# Altium project LaunchpadStepperXY.PrjPCB
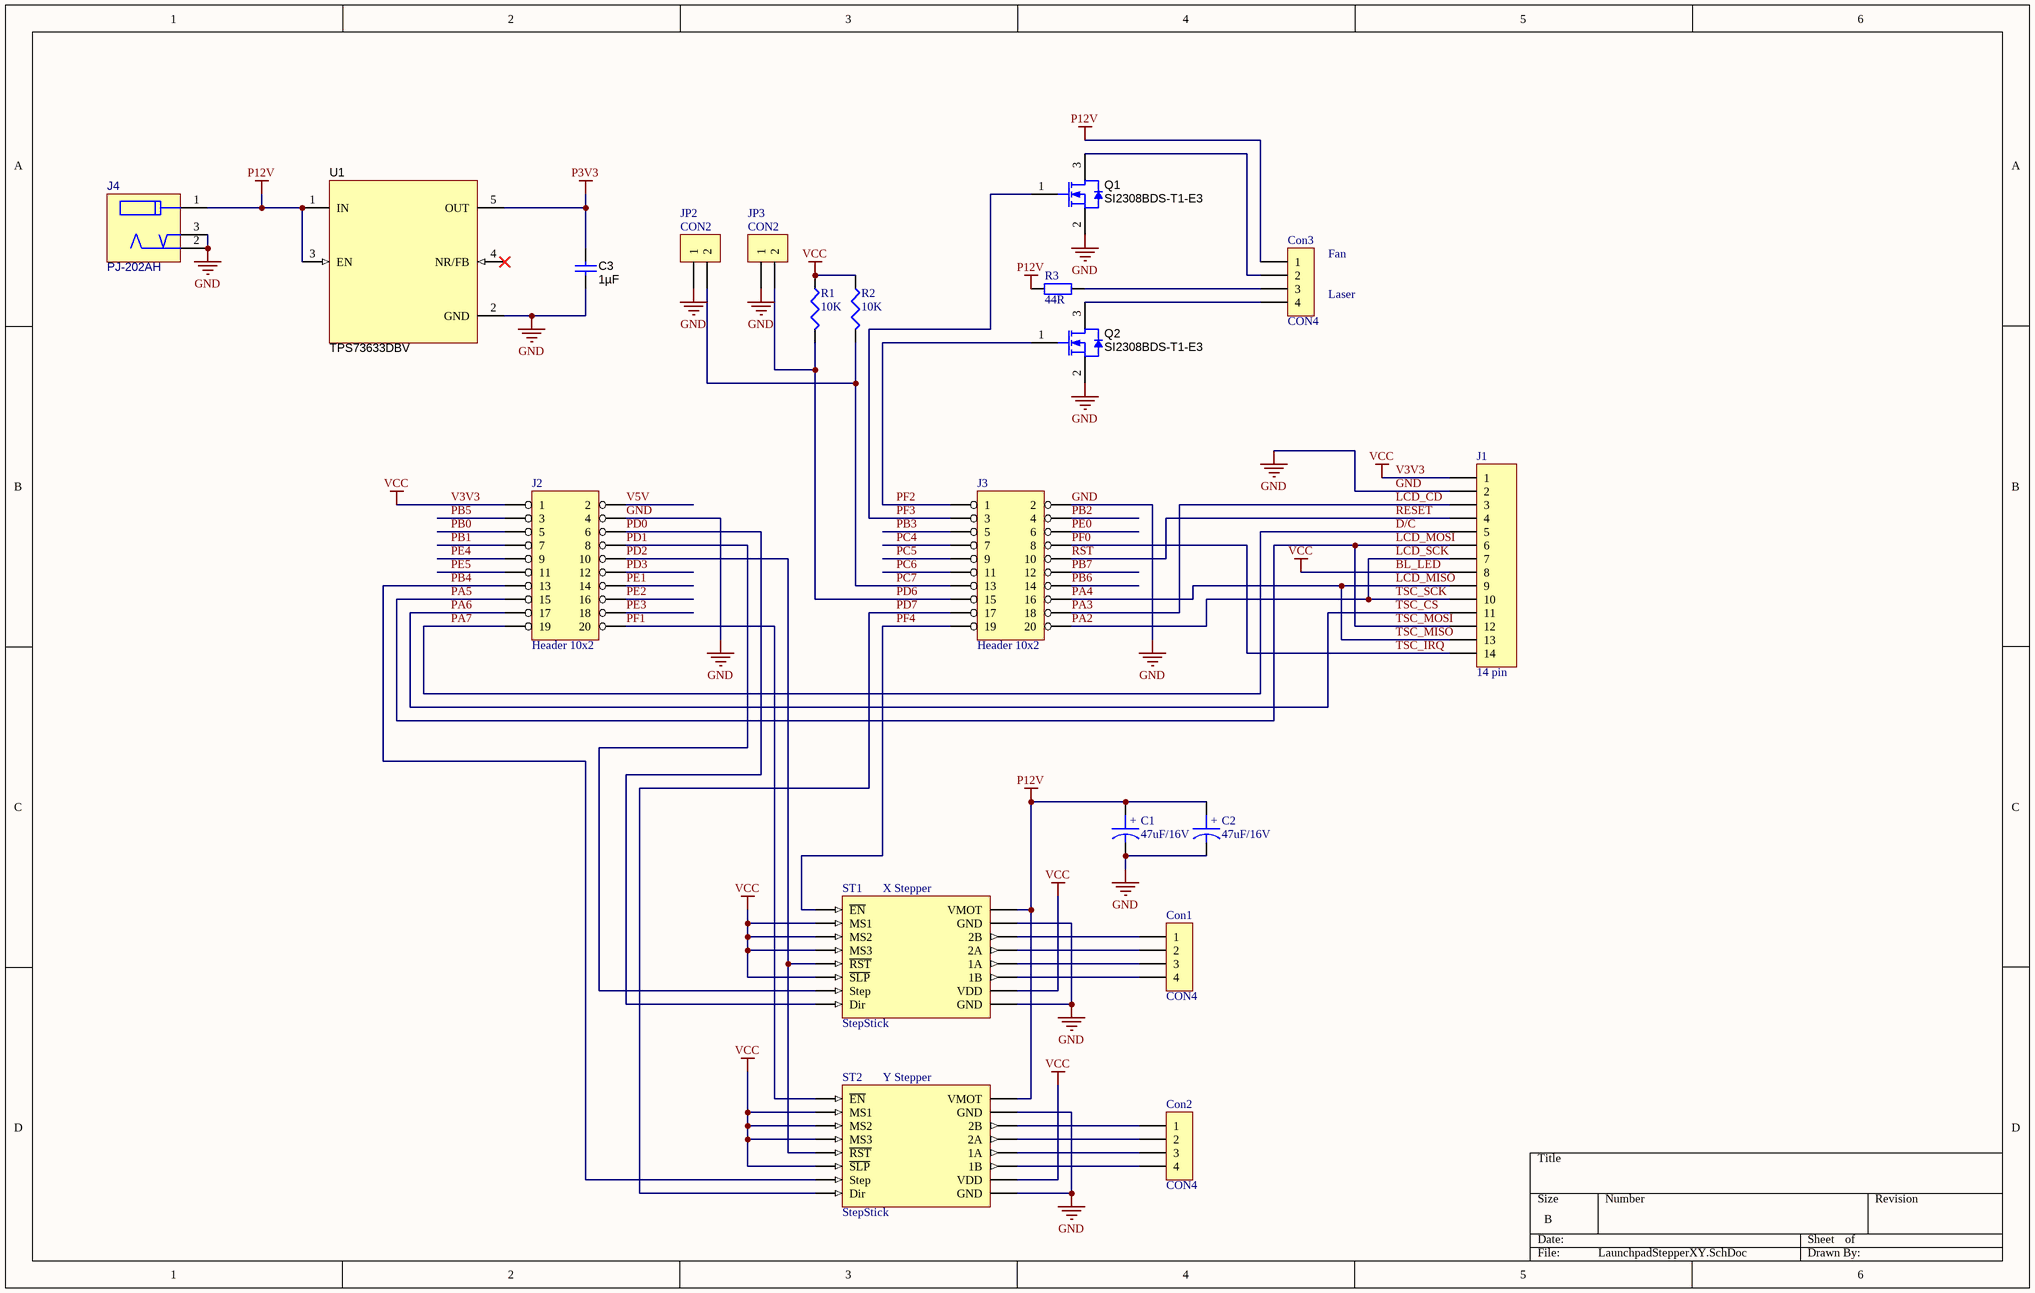
[diagram p0: LaunchpadStepperXY.SchDoc]
1 sheet, 20 parts. Net scope: global (net labels, ports and power ports of the same name join across sheets).
Board file: LaunchpadStepperXY.PcbDoc

## Sheet LaunchpadStepperXY.SchDoc
size B

### Parts
C1  47uF/16V  [PanasonicD]
C2  47uF/16V  [PanasonicD]
C3  ValueDisplayed: 1µF  [0603]  (hidden comment: UMK107AB7105KA-T)
Con1  CON4  [SIP4]
Con2  CON4  [SIP4]
Con3  CON4  [SIP4]
J1  14 pin  [SIP14]
J2  Header 10x2  [IDC20]
J3  Header 10x2  [IDC20]
J4  PJ-202AH  [CONN_CUI-PJ-202AH]
JP2  CON2  [SIP2]
JP3  CON2  [SIP2]
Q1  SI2308BDS-T1-E3  [SOT-23]
Q2  SI2308BDS-T1-E3  [SOT-23]
R1  10K  [0603]
R2  10K  [0603]
R3  44R  [AXIAL-0.4]
ST1  StepStick  [StepStick]
ST2  StepStick  [StepStick]
U1  TPS73633DBV  [DBV0005A_N]

### Nets
BL_LED: J1.1 J1.8 J2.1 R1.1 R2.1 ST1.2(MS1) ST1.3(MS2) ST1.4(MS3) ST1.6(~{SLP}) ST1.10(VDD) ST2.2(MS1) ST2.3(MS2) ST2.4(MS3) ST2.6(~{SLP}) ST2.10(VDD)  [also labelled V3V3, VCC]
GND: C1.2 C2.2 C3.2 J1.2 J2.4 J3.2 J4.2 J4.3 JP2.1 JP3.1 Q1.2(S) Q2.2(S) ST1.9(GND) ST1.15(GND) ST2.9(GND) ST2.15(GND) U1.2(GND)
P3V3: C3.1 U1.5(OUT)
P12V: C1.1 C2.1 Con3.1 J4.1 R3.2 ST1.16(VMOT) ST2.16(VMOT) U1.1(IN) U1.3(EN)
D/C: J1.5 J2.19  [also labelled PA7]
LCD_CD: J1.3 J3.18  [also labelled PA3]
LCD_MISO: J1.9 J1.13 J3.16  [also labelled PA4, TSC_MISO]
LCD_MOSI: J1.6 J1.12 J2.15  [also labelled PA5, TSC_MOSI]
LCD_SCK: J1.7 J1.10 J3.20  [also labelled PA2, TSC_SCK]
PA6: J1.11 J2.17  [also labelled TSC_CS]
PB0: J2.5
PB1: J2.7
PB2: J3.4
PB3: J3.5
PB4: J2.13 ST2.7(Step)
PB5: J2.3
PB6: J3.14
PB7: J3.12
PC4: J3.7
PC5: J3.9
PC6: J3.11
PC7: J3.13 JP2.2 R2.2
PD0: J2.6 ST1.8(Dir)
PD1: J2.8 ST1.7(Step)
PD2: J2.10 ST1.5(~{RST}) ST2.5(~{RST})
PD3: J2.12
PD6: J3.15 JP3.2 R1.2
PD7: J3.17 ST2.8(Dir)
PE0: J3.6
PE1: J2.14
PE2: J2.16
PE3: J2.18
PE4: J2.9
PE5: J2.11
PF0: J1.14 J3.8  [also labelled TSC_IRQ]
PF1: J2.20 ST2.1(~{EN})
PF2: J3.1 Q2.1(G)
PF3: J3.3 Q1.1(G)
PF4: J3.19 ST1.1(~{EN})
~{RESET}: J1.4 J3.10  [also labelled ~{RST}]
V5V: J2.2
NetCon1_1: Con1.1 ST1.14(2B)
NetCon1_2: Con1.2 ST1.13(2A)
NetCon1_3: Con1.3 ST1.12(1A)
NetCon1_4: Con1.4 ST1.11(1B)
NetCon2_1: Con2.1 ST2.14(2B)
NetCon2_2: Con2.2 ST2.13(2A)
NetCon2_3: Con2.3 ST2.12(1A)
NetCon2_4: Con2.4 ST2.11(1B)
NetCon3_2: Con3.2 Q1.3(D)
NetCon3_3: Con3.3 R3.1
NetCon3_4: Con3.4 Q2.3(D)

Not connected (* = marked no-connect by the designer): U1 4(NR/FB)*

### Notes on the sheet
- (near Con3) Fan
- (near Con3) Laser
- (near ST1) X Stepper
- (near ST2) Y Stepper
- (in symbol C_POL) +

### Library data of the parts
C1 C2 = C_POL: Polarized Capacitor; Manufacturer: Panasonic; Manufacturer number: EEE-HC1V221P; Cost 1x: 0.557; Distributor: Digikey; Cost 25x: 0.557; Distributor number: PCE3760CT-ND
C3 = UMK107AB7105KA-T: CAP, CERM, 1 µF, 50 V, +/- 10%, X7R, 0603; Manufacturer: Taiyo Yuden; Polarized: N; CompType: Capacitor; Value: 1uF; U/M: EA; Cap_F: 0.000001; Tolerance_%: 10; Value1: Unknown; VDC_V: 50; Value2: 50V; TaMin_C: -55; TaMax_C: 125; SymbolVersion: 2008-07-09; PartNumber: UMK107AB7105KA-T; PackageReference: 0603; RoHS: Y; MountType: SMT; Technology: Ceramic; TempCo: X7R; Cap_Case: 0603; Published: 2008-06-19; Publisher: Texas Instruments; LatestRevisionDate: 2015-05-08; ComponentLink1Description: Datasheet link; ComponentLink1URL: http://www.yuden.co.jp/ut/product/category/capacitor/UMK107AB7105KA-T.pdf; Supplier 1: Digi-Key; Supplier Part Number 1: 587-3247-1-ND; Supplier 2: Mouser; Supplier Part Number 2: 963-UMK107AB7105KA-T; Supplier 3: Newark; Supplier Part Number 3: 45W1781
J1 = CON14: Connector
J4 = PJ-202AH: Connector, DC Jack 2.1X5.5 mm, TH; Manufacturer: CUI Inc.; SymbolCreator: a0799628; CompType: Power Jack; SymbolVersion: 2013-07-18; PartNumber: PJ-202AH; PackageReference: Conn, DC Jack, pin  2mm Dia.; RoHS: Y; MountType: TH; ComponentLink1Description: Datasheet URL; ComponentLink1URL: http://www.cui.com/Product/Resource/PJ-202AH.pdf#toolbar=1&navpanes=0&scrollbar=1&view=FitH; Publisher: Texas Instruments; LatestRevisionDate: 2016-02-25; Supplier 1: Digi-Key; Supplier Part Number 1: CP-202AH-ND
JP2 JP3 = CON2: Connector
Q1 Q2 = SI2308BDS-T1-E3: MOSFET, N-CH, 60 V, 2.3 A, SOT-23; Manufacturer: Vishay-Siliconix; Alternate Manufacturer: None; U/M: EA; ChType: N; Value: 60V; VdsMax_V: 60; Value1: 0.192 ohm; Rdson45_ohm: 0.192; Value2: 2.3 nC; QgTyp_nC: 2.3; Vgs_V: 20; SizeAreaWB_mm2: 14; SizeArea_mm2: 7.5; SizeX_mm: 2.5; SizeY_mm: 3; SizeZ_mm: 1.1; AEC Category: Q101; SymbolVersion: 2008-07-28; CompType: MOSFET; PartNumber: SI2308BDS-T1-E3; PackageReference: SOT-23; IdsMax_A: 2.3; RoHS: Y; MountType: SMT; Published: 2008-06-19; Publisher: Texas Instruments; LatestRevisionDate: 2016-06-13; LatestRevisionNote: Added parts.; ComponentLink1Description: Datasheet link; ComponentLink1URL: http://www.vishay.com/docs/69958/si2308bd.pdf; Supplier 1: Digi-Key; Supplier Part Number 1: SI2308BDS-T1-E3CT-ND; Supplier 2: Mouser; Supplier Part Number 2: 781-SI2308BDS-E3; Supplier 3: Farnell; Supplier Part Number 3: 2459410; AEC Qualified: N
R1 R2 = RES: Resistor; TC: *
R3 = Res2: Resistor; Value: 1K; Published: 8-Jun-2000; LatestRevisionDate: 17-Jul-2002; LatestRevisionNote: Re-released for DXP Platform.; PackageReference: AXIAL-0.4; Publisher: Altium Limited; PackageDescription: Axial Device, Thru-Hole; 2 Leads; 0.4 in Pin Spacing
ST1 ST2 = CON14_1: Connector
U1 = TPS73633DBV: Cap-Free, NMOS, 400mA Low-Dropout Regulator with Reverse Current Protection, DBV0005A; Manufacturer: Texas Instruments; SymbolCreator: a0411947; CompType: IC; U/M: EA; SymbolVersion: 2013-06-17; PartNumber: TPS73633DBV; PackageReference: DBV0005A; MountType: SMT; ComponentLink1Description: Datasheet Link; ComponentLink1URL: http://www.ti.com/lit/ds/symlink/tps73601.pdf; RoHS: Y; Publisher: Texas Instruments; LatestRevisionDate: 2015-05-04; Alternate Manufacturer: Texas Instruments